# EAGLE schematic Platform3DOF (EAGLE 8.3.1)
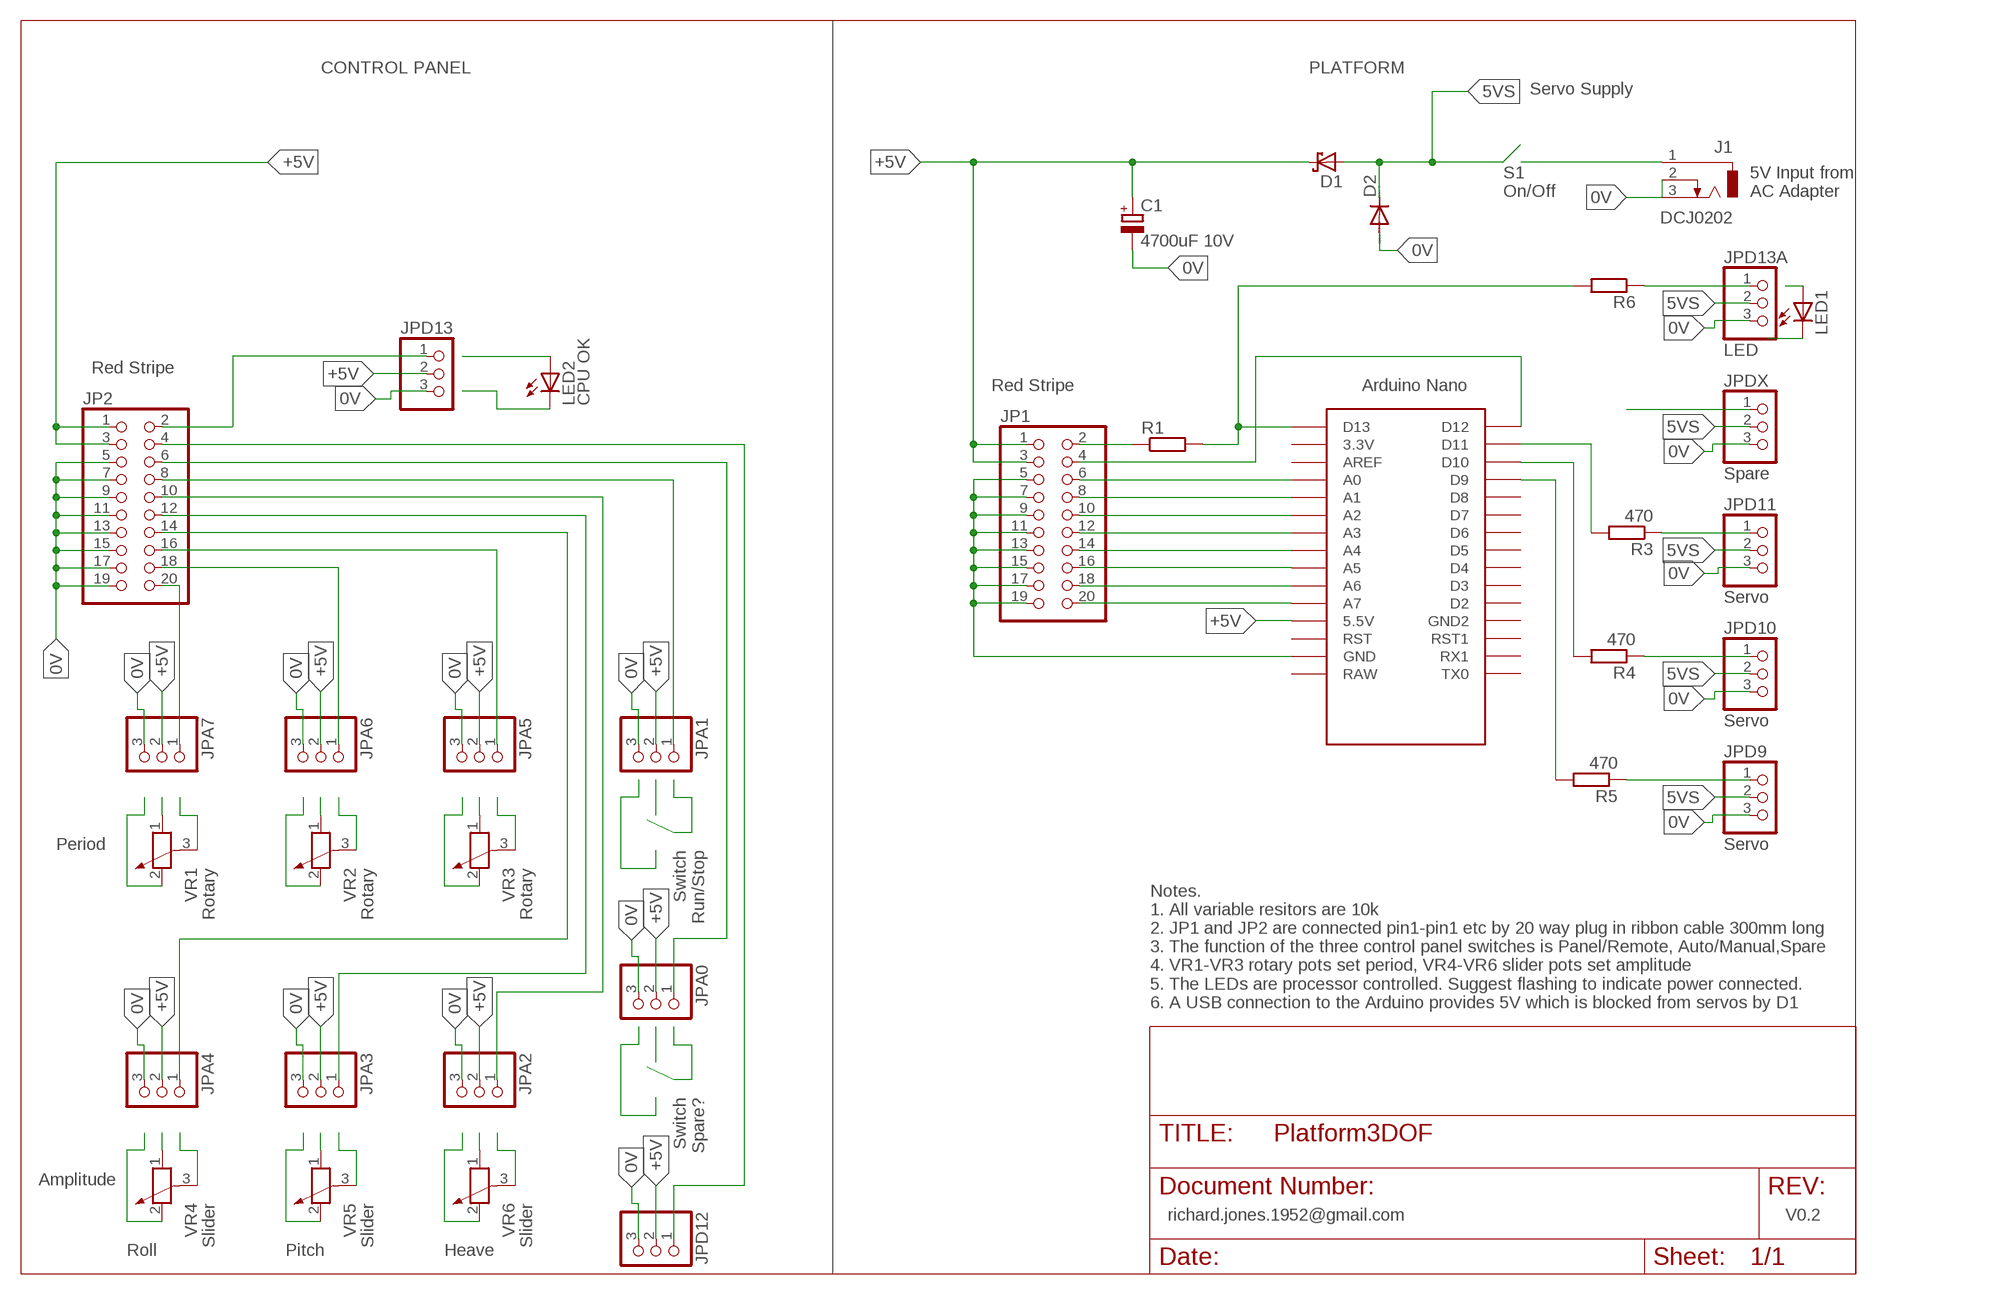
[diagram p0: schematic, sheet 1]

## Parts
C1  4700uF 10V  CPOL-EUTAP5-80  [TAP5-80]
D1  SCHOTTKY-DIODEAG  [AG]
D2  DIODE-DO41-7.6  [DO41-7.6]
J1  DCJ0202  [DCJ0202]
JP1  PINHD-2X10  [2X10]
JP2  PINHD-2X10  [2X10]
JPA0  PINHD-1X3  [1X03]
JPA1  PINHD-1X3  [1X03]
JPA2  PINHD-1X3  [1X03]
JPA3  PINHD-1X3  [1X03]
JPA4  PINHD-1X3  [1X03]
JPA5  PINHD-1X3  [1X03]
JPA6  PINHD-1X3  [1X03]
JPA7  PINHD-1X3  [1X03]
JPD9  Servo  PINHD-1X3  [1X03]
JPD10  Servo  PINHD-1X3  [1X03]
JPD11  Servo  PINHD-1X3  [1X03]
JPD12  PINHD-1X3  [1X03]
JPD13  PINHD-1X3  [1X03]
JPD13A  LED  PINHD-1X3  [1X03]
JPDX  Spare  PINHD-1X3  [1X03]
LED1  LED3MM  [LED3MM]
LED2  CPU OK  LED5MM  [LED5MM]
R1  R-EU_R0805  [R0805]
R3  470  R-EU_R0805  [R0805]
R4  470  R-EU_R0805  [R0805]
R5  470  R-EU_R0805  [R0805]
R6  R-EU_R0805  [R0805]
U$1  NANO  [NANO]
VR1  Rotary  POTENTIOMETER_PT-10  [PT-10]
VR2  Rotary  POTENTIOMETER_PT-10  [PT-10]
VR3  Rotary  POTENTIOMETER_PT-10  [PT-10]
VR4  Slider  POTENTIOMETER_PT-10  [PT-10]
VR5  Slider  POTENTIOMETER_PT-10  [PT-10]
VR6  Slider  POTENTIOMETER_PT-10  [PT-10]

## Nets
0V: C1.- D2.A JP2.5 JP2.7 JP2.9 JP2.11 JP2.13 JP2.15 JP2.17 JP2.19 JPA0.3 JPA1.3 JPA2.3 JPA3.3 JPA4.3 JPA5.3 JPA6.3 JPA7.3 JPD9.3 JPD10.3 JPD11.3 JPD12.3 JPD13.3 JPD13A.3 JPDX.3
5VS: D1.A D2.C JPD9.2 JPD10.2 JPD11.2 JPD13A.2 JPDX.2
+5V: C1.+ D1.C JP1.1 JP1.3 JP2.1 JP2.3 JPA0.2 JPA1.2 JPA2.2 JPA3.2 JPA4.2 JPA5.2 JPA6.2 JPA7.2 JPD12.2 JPD13.2 U$1.5V(5.5V)
N$1: JP1.20 U$1.A7
N$2: JP1.18 U$1.A6
N$3: JP1.16 U$1.A5
N$4: JP1.14 U$1.A4
N$5: JP1.12 U$1.A3
N$6: JP1.10 U$1.A2
N$7: JP1.8 U$1.A1
N$8: JP1.6 U$1.A0
N$9: JP1.2 R1.1
N$10: JP1.4 U$1.D12
N$11: VR2.1
N$12: R3.2 U$1.D11
N$13: VR2.2
N$14: VR2.3
N$15: VR3.1
N$16: JP2.4 JPD12.1
N$17: JP2.6 JPA0.1
N$18: JP2.8 JPA1.1
N$19: LED2.A
N$20: LED2.K(C)
N$21: R1.2 R6.2 U$1.D13
N$25: VR3.2
N$26: JP2.18 JPA6.1
N$27: JP2.20 JPA7.1
N$28: VR3.3
N$29: JP2.14 JPA4.1
N$30: JP2.12 JPA3.1
N$31: JP2.16 JPA5.1
N$32: VR4.1
N$33: VR4.2
N$34: VR4.3
N$35: VR5.1
N$36: VR1.1
N$37: VR1.2
N$38: VR1.3
N$39: VR5.2
N$40: VR5.3
N$41: VR6.1
N$42: VR6.2
N$43: VR6.3
N$44: JP2.10 JPA2.1
N$45: JP1.5 JP1.7 JP1.9 JP1.11 JP1.13 JP1.15 JP1.17 JP1.19 U$1.GND
N$46: JPD11.1 R3.1
N$50: R4.2 U$1.D10
N$51: R5.2 U$1.D9
N$52: JPD9.1 R5.1
N$53: JPD10.1 R4.1
N$54: J1.2 J1.3
N$55: J1.1
N$56: JPDX.1
N$57: JPD13A.1 R6.1
N$58: LED1.A
N$59: LED1.K(C)
N$60: JP2.2 JPD13.1
Unconnected: U$1.3.3V U$1.AREF U$1.D2 U$1.D3 U$1.D4 U$1.D5 U$1.D6 U$1.D7 U$1.D8 U$1.GND1(GND2) U$1.ICSP1 U$1.ICSP2 U$1.ICSP3 U$1.ICSP4 U$1.ICSP5 U$1.ICSP6 U$1.RAW U$1.RST U$1.RST1 U$1.RX1 U$1.TX0

## Notes on the sheet
- CONTROL PANEL | PLATFORM
- Servo Supply
- S1
  On/Off
- 5V Input from
  AC Adapter
- Red Stripe
- Red Stripe
- Period
- Switch
  Run/Stop
- Notes.
  1. All variable resitors are 10k
  2. JP1 and JP2 are connected pin1-pin1 etc by 20 way plug in ribbon cable 300mm long
  3. The function of the three control panel switches is Panel/Remote, Auto/Manual,Spare
  4. VR1-VR3 rotary pots set period, VR4-VR6 slider pots set amplitude
  5. The LEDs are processor controlled. Suggest flashing to indicate power connected.
  6. A USB connection to the Arduino provides 5V which is blocked from servos by D1
- Switch
  Spare?
- Amplitude
- richard.jones.1952@gmail.com | V0.2
- Roll | Pitch | Heave

## Library data of the parts
C1 = resistor:CPOL-EU: POLARIZED CAPACITOR, European symbol
D1 = diode:SCHOTTKY-DIODE: Schottky Diode
D2 = diode:DIODE-: DIODE
J1 = con-jack:DCJ0202: DC POWER JACK Source: DCJ0202.pdf; OC_FARNELL: unknown; OC_NEWARK: unknown
JP1 JP2 = pinhead:PINHD-2X10: PIN HEADER
JPA0 JPA1-JPA7 JPD9-JPD13 JPD13A JPDX = pinhead:PINHD-1X3: PIN HEADER
LED1 LED2 = led:LED: LED OSRAM: - CHIPLED LG R971, LG N971, LY N971, LG Q971, LY Q971, LO R971, LY R971 LH N974, LH R974 LS Q976, LO Q976, LY Q976 LO Q996 - Hyper CHIPLED LW Q18S LB Q993, LB Q99A, LB R99A - SideLED LS A670, LO A670, LY A670, LG A670, LP A670 LB A673, LV A673, LT A673, LW A673 LH A674 LY A675 LS A676, LA A676, LO A676, LY A676, LW A676 LS A679, LY A679, LG A679 - Hyper Micro SIDELED® LS Y876, LA Y876, LO Y876, LY Y876 LT Y87S - SmartLED LW L88C, LW L88S LB L89C, LB L89S, LG L890 LS L89K, LO L89K, LY L89K LS L896, LA L896, LO L896, LY L896 - TOPLED LS T670, LO T670, LY T670, LG T670, LP T670 LSG T670, LSP T670, LSY T670, LOP T670, LYG T670 LG T671, LOG T671, LSG T671 LB T673, LV T673, LT T673, LW T673 LH T674 LS T676, LA T676, LO T676, LY T676, LB T676, LH T676, LSB T676, LW T676 LB T67C, LV T67C, LT T67C, LS T67K, LO T67K, LY T67K, LW E67C LS E67B, LA E67B, LO E67B, LY E67B, LB E67C, LV E67C, LT E67C LW T67C LS T679, LY T679, LG T679 LS T770, LO T770, LY T770, LG T770, LP T770 LB T773, LV T773, LT T773, LW T773 LH T774 LS E675, LA E675, LY E675, LS T675 LS T776, LA T776, LO T776, LY T776, LB T776 LHGB T686 LT T68C, LB T68C - Hyper Mini TOPLED® LB M676 - Mini TOPLED Santana® LG M470 LS M47K, LO M47K, LY M47K Source: http://www.osram.convergy.de LUXEON: - LUMILED® LXK2-PW12-R00, LXK2-PW12-S00, LXK2-PW14-U00, LXK2-PW14-V00 LXK2-PM12-R00, LXK2-PM12-S00, LXK2-PM14-U00 LXK2-PE12-Q00, LXK2-PE12-R00, LXK2-PE12-S00, LXK2-PE14-T00, LXK2-PE14-U00 LXK2-PB12-K00, LXK2-PB12-L00, LXK2-PB12-M00, LXK2-PB14-N00, LXK2-PB14-P00, LXK2-PB14-Q00 LXK2-PR12-L00, LXK2-PR12-M00, LXK2-PR14-Q00, LXK2-PR14-R00 LXK2-PD12-Q00, LXK2-PD12-R00, LXK2-PD12-S00 LXK2-PH12-R00, LXK2-PH12-S00 LXK2-PL12-P00, LXK2-PL12-Q00, LXK2-PL12-R00 Source: www.luxeon.com KINGBRIGHT: KA-3528ASYC Source: www.kingbright.com
R1 R3-R6 = rcl:R-EU_: RESISTOR, European symbol
U$1 = Arduino-clone:NANO: Arduino Nano
VR1-VR6 = rcl:POTENTIOMETER_: Potentiometer